# Altium schematic sheet Power_24V_Rev1.1.SchDoc
size A4
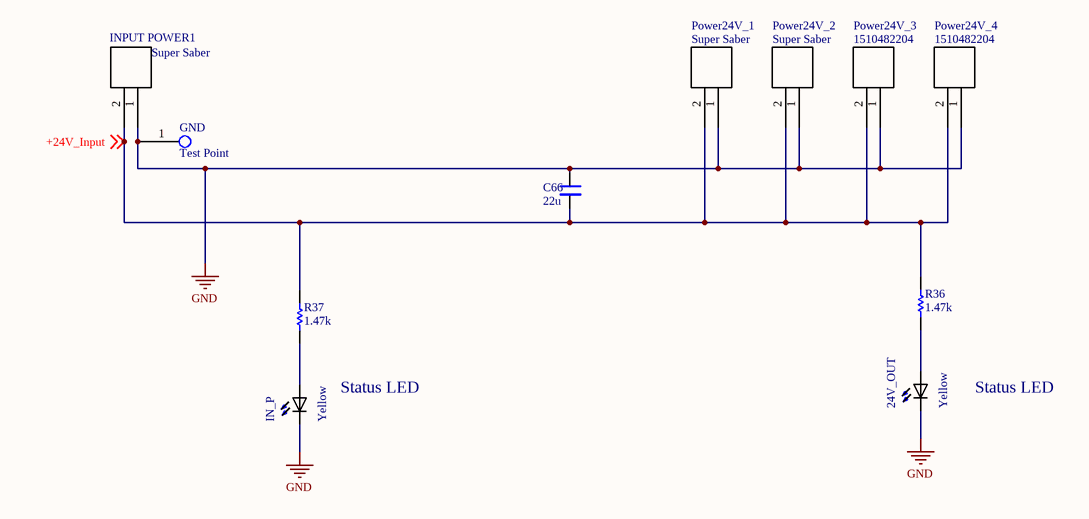
[diagram p0: Power_24V_Rev1.1.SchDoc]

## Parts
24V_OUT  Yellow  [*DIOC200X125X110_LTST-C171KSKT(Primary)]
C66  22u  [*CAPC2012X88N]
GND  Test Point  [Test Point Through-hole]
IN_P  Yellow  [*DIOC200X125X110_LTST-C171KSKT(Primary)]
INPUT_POWER1  Super Saber  [1720420202]
Power24V_1  Super Saber  [1720420202]
Power24V_2  Super Saber  [1720420202]
Power24V_3  1510482204  [1510482204]
Power24V_4  1510482204  [1510482204]
R36  1.47k  [RESC0805(2012)_M]
R37  1.47k  [RESC0805(2012)_M]

## Nets
GND: 24V_OUT.NEG C66.2 GND.1 IN_P.NEG INPUT_POWER1.1 Power24V_1.1 Power24V_2.1 Power24V_3.1 Power24V_4.1
+24V_Input: C66.1 INPUT_POWER1.2 Power24V_1.2 Power24V_2.2 Power24V_3.2 Power24V_4.2 R36.2 R37.2 ; off-sheet +24V_Input
Net24V_OUT_POS: 24V_OUT.POS R36.1
NetIN_P_POS: IN_P.POS R37.1

## Notes on the sheet
- Status LED
- Title
- Size:
- Date:
- A4
- Number:
- Time:
- Revision:
- Sheet
- of
- File:

## Library data of the parts
24V_OUT IN_P = LTST-C171KSKT: / Yellow 2 x 1.25 x 0.8 mm 130Â° Water Clear 50 mcd 2 V LED SMT /; MF: Lite-On Inc.; SnapEDA_Link: https://www.snapeda.com/parts/LTST-C171KSKT/Lite-On%20Inc./view-part/?ref=snap; Package: 0805 Lite-On; MP: LTST-C171KSKT; Digi-Key_Part_Number: 160-1428-1-ND; Digi-Key_Purchase_URL: https://www.digikey.com/product-detail/en/lite-on-inc/LTST-C171KSKT/160-1428-1-ND/386802?utm_source=snapeda&utm_medium=aggregator&utm_campaign=symbol; Value: *
C66 = C0805C101JAGAC7800: / 100pF Â±5% 250V Ceramic Capacitor C0G, NP0 0805 _2012 Metric_ /; MF: KEMET; Package: 0805 KEMET; Digi-Key_Part_Number: 399-15000-1-ND; MP: C0805C101JAGAC7800; Digi-Key_Purchase_URL: https://www.digikey.com/product-detail/en/kemet/C0805C101JAGAC7800/399-15000-1-ND/7382549?utm_source=snapeda&utm_medium=aggregator&utm_campaign=symbol; SnapEDA_Link: https://www.snapeda.com/parts/C0805C101JAGAC7800/KEMET/view-part/3661430/?ref=snap; Value: *
Power24V_3 Power24V_4 = 1510482204: Molex 6.5MM 2 pin connector, used for power connections. P/N 1510482204 and similar models.
R36 R37 = CMP-1013-00951-1: 8M06 0.125W 1% 0805 (2012 Metric)  SMD; Value: 8060000.00 Ohm; Case-EIA: 0805; Case-Metric: 2012; Power: 0.125 W; Technology: SMT; Tolerance: 1 %